# Altium schematic sheet TOP_LEVEL.SchDoc: Camera Carrier Board
size A; Date: 2024/5/1; Author: Anthony Andrews; DocumentNumber: 1; Revision: 0; SheetNumber: 1; SheetTotal: 2
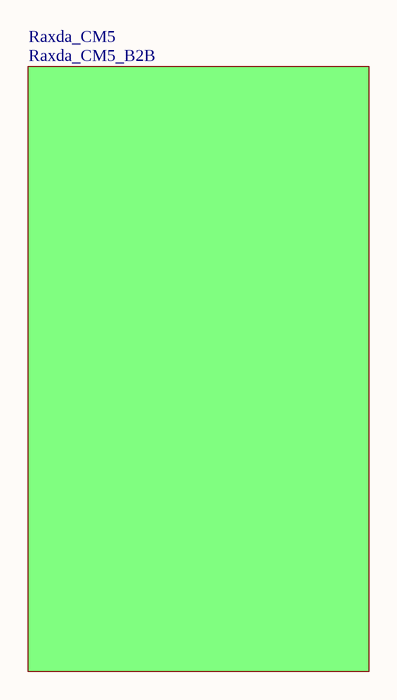
[diagram p0: TOP_LEVEL.SchDoc]

## Sub-sheets
Raxda_CM5 = Raxda_CM5_B2B: no entries